# Altium schematic sheet schematic_updated.SchDoc
size 594 x 420 mm
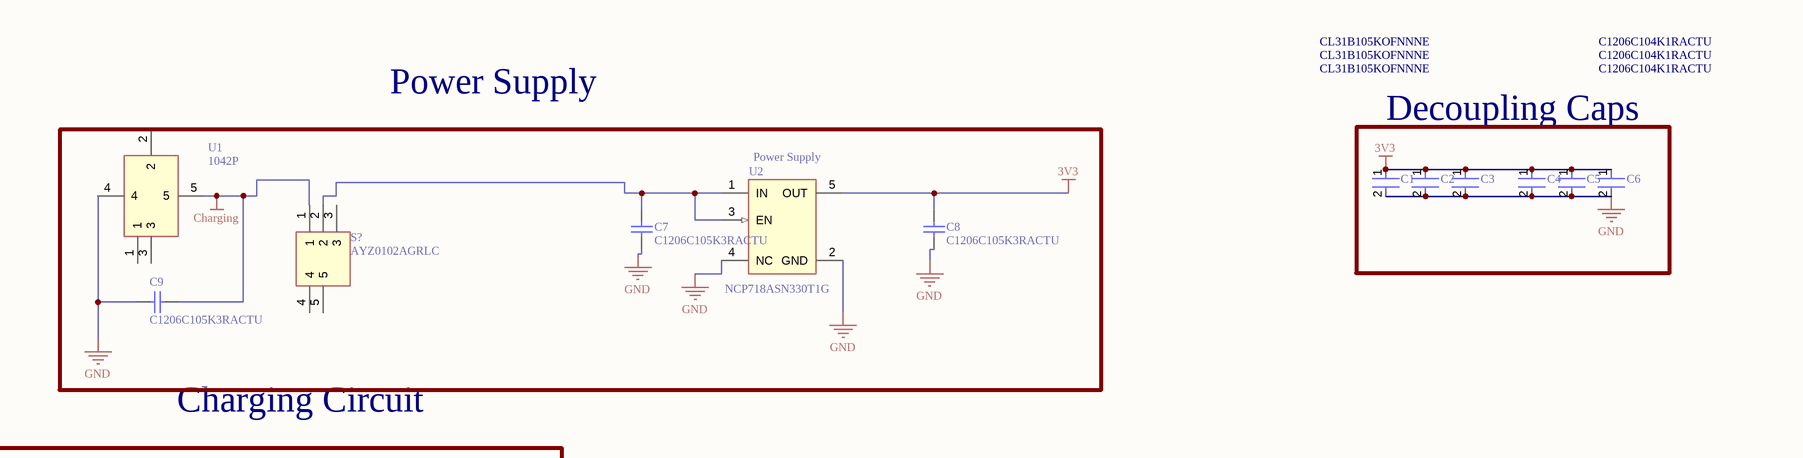
[diagram p0: schematic_updated.SchDoc, top left]
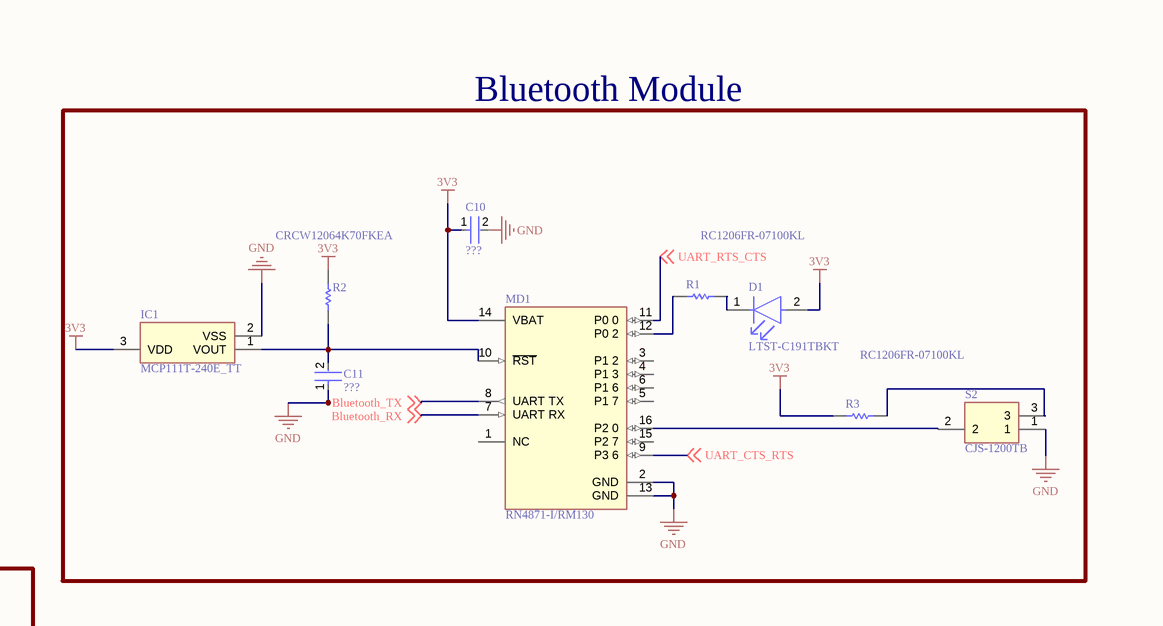
[diagram p1: schematic_updated.SchDoc, top right]
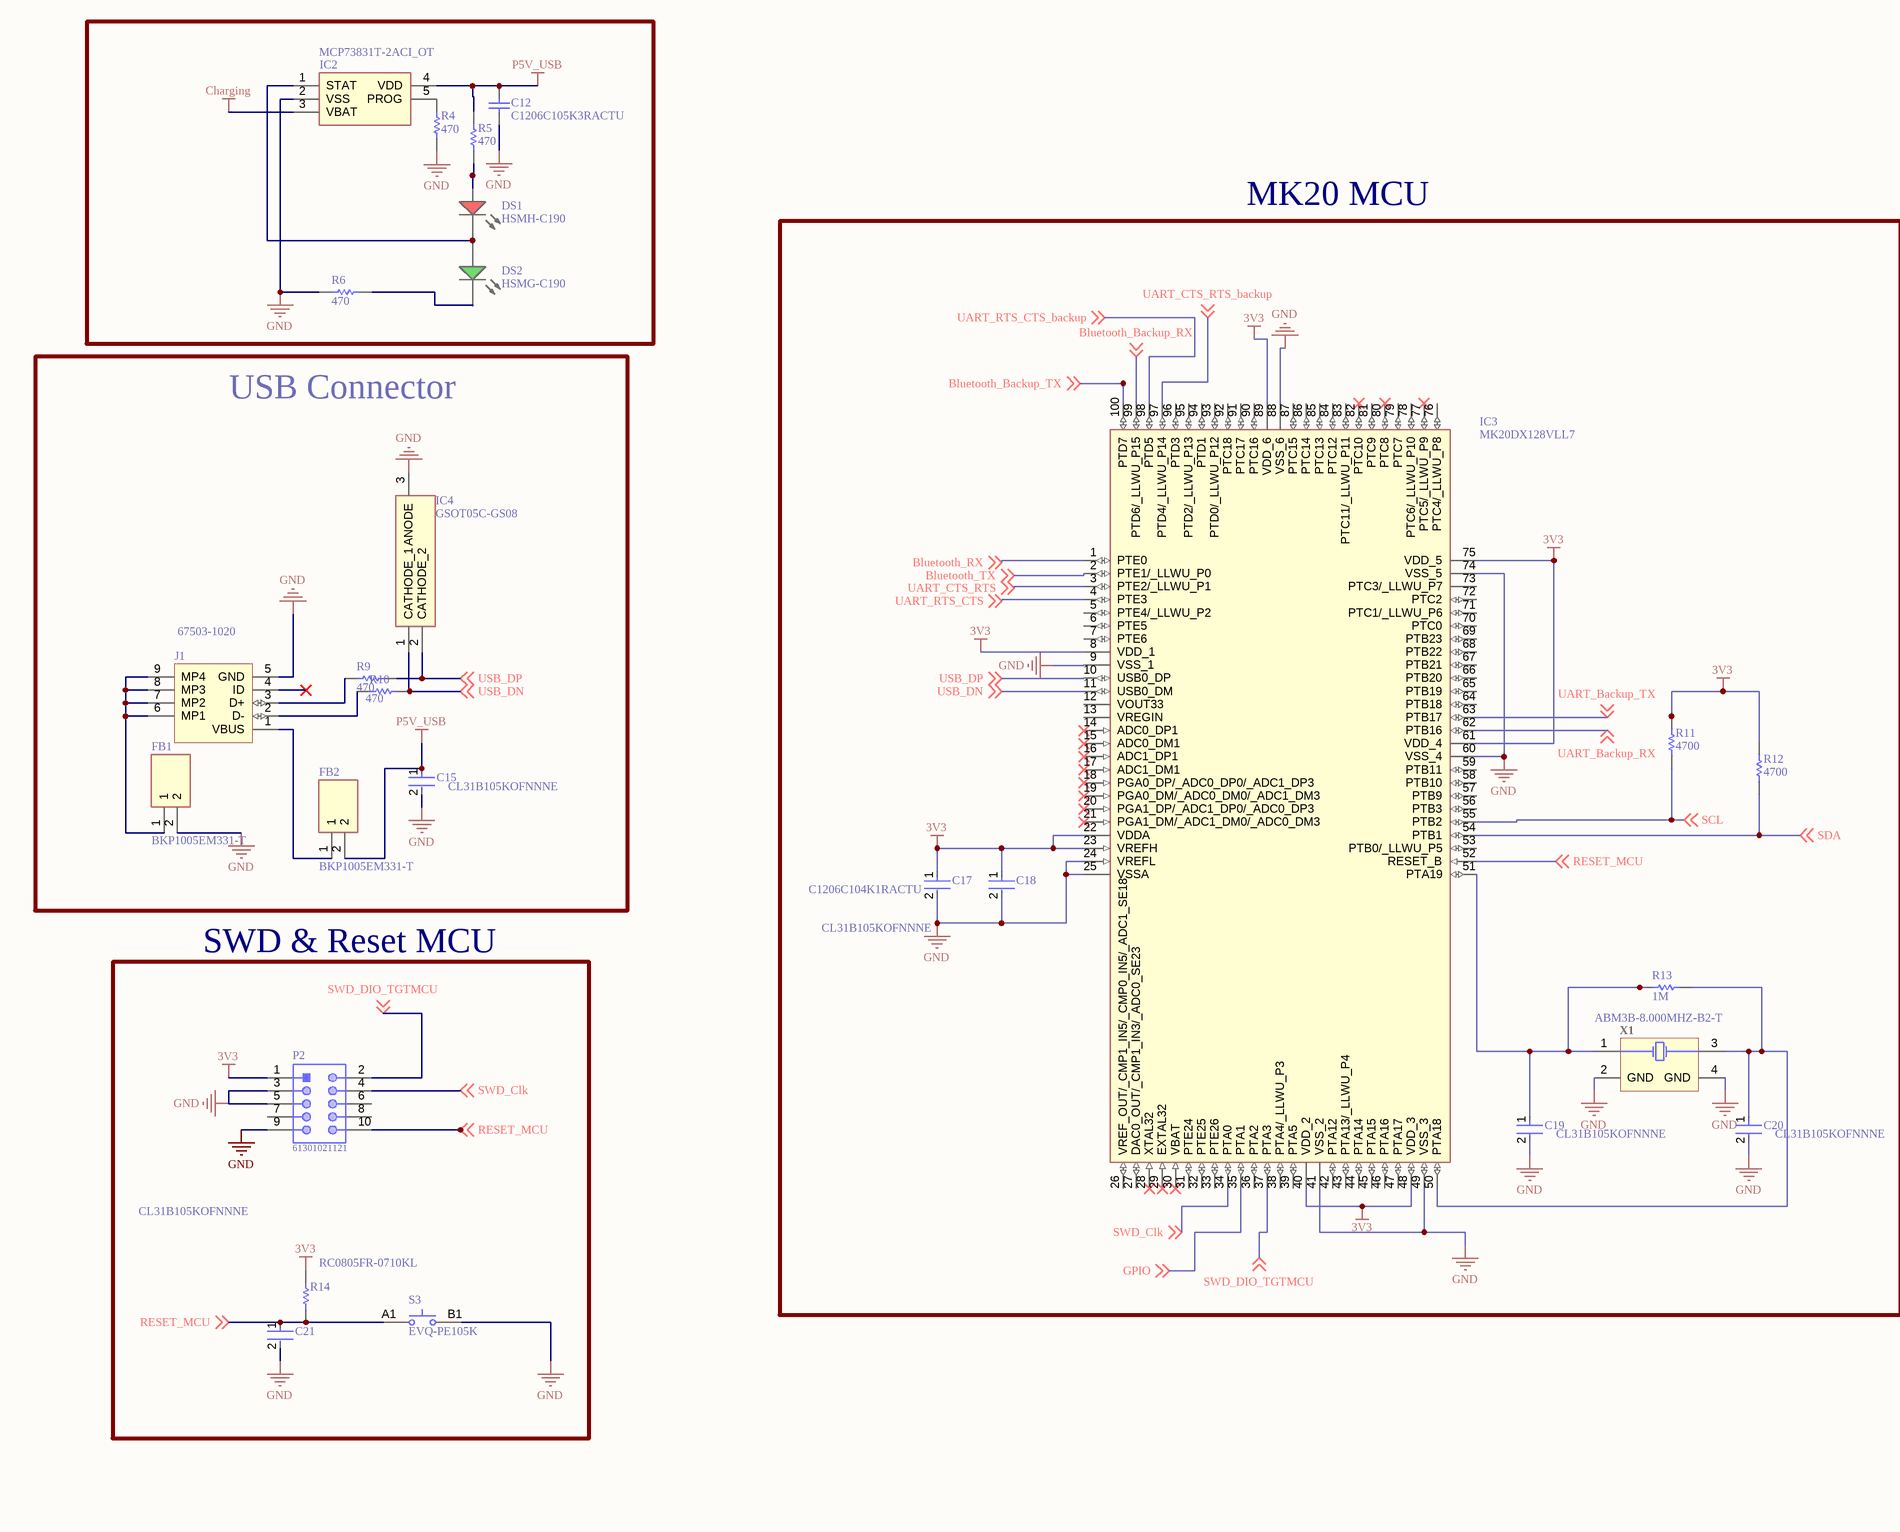
[diagram p2: schematic_updated.SchDoc, bottom left]
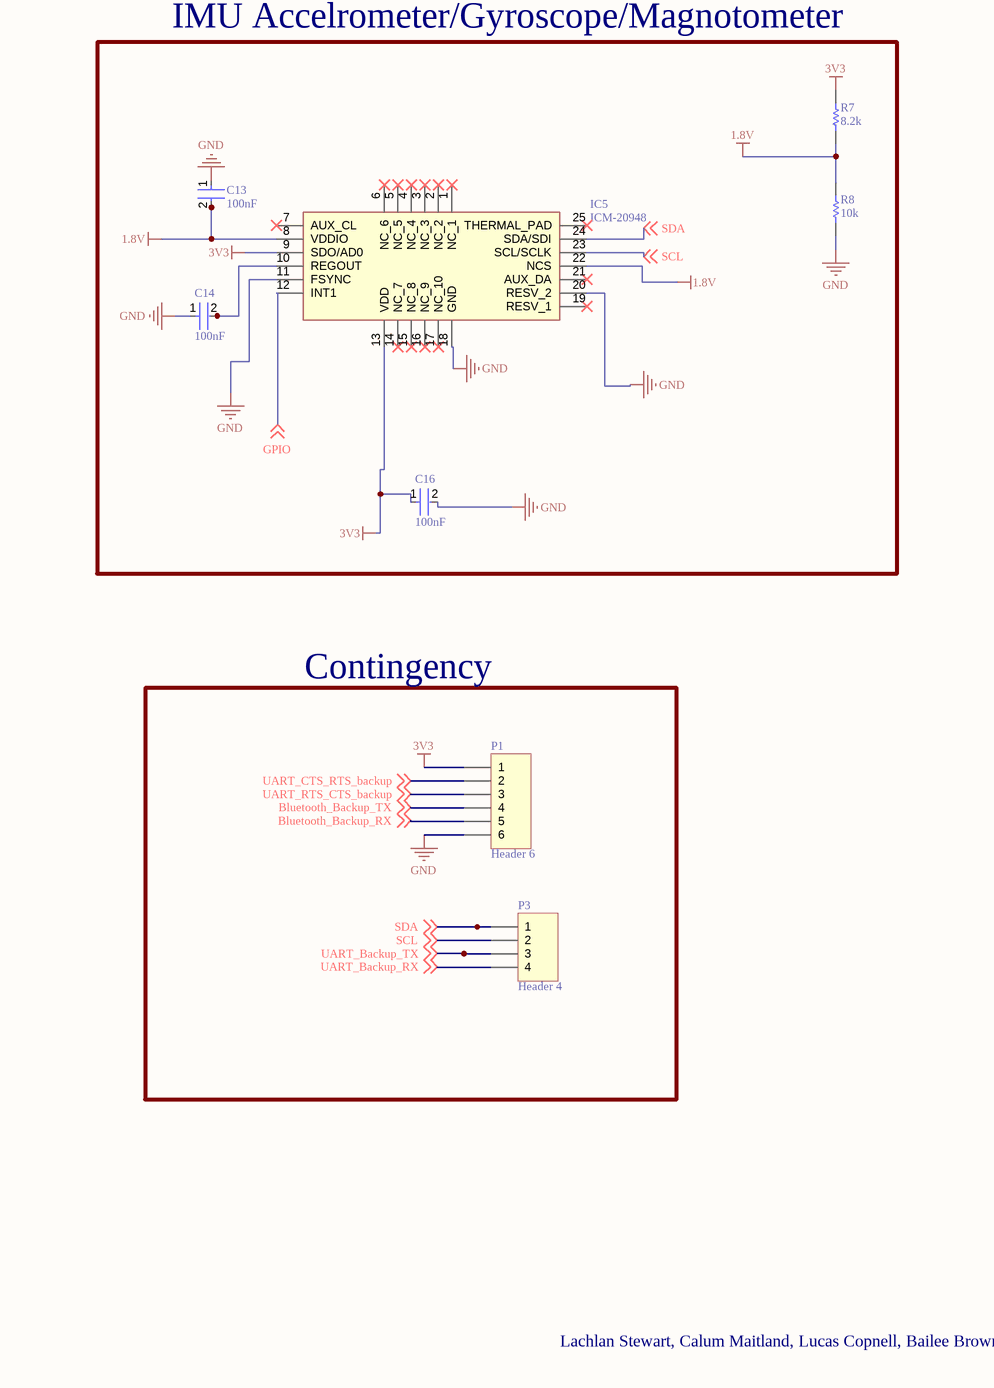
[diagram p3: schematic_updated.SchDoc, bottom right]

## Parts
C1  CL31B105KOFNNNE  [FP-CL31-IPC_C]
C2  CL31B105KOFNNNE  [FP-CL31-IPC_C]
C3  CL31B105KOFNNNE  [FP-CL31-IPC_C]
C4  C1206C104K1RACTU  [FP-C1206C-EB-MFG]
C5  C1206C104K1RACTU  [FP-C1206C-EB-MFG]
C6  C1206C104K1RACTU  [FP-C1206C-EB-MFG]
C7  C1206C105K3RACTU  [CAPC3216X180X50ML20T25]
C8  C1206C105K3RACTU  [CAPC3216X180X50ML20T25]
C9  C1206C105K3RACTU  [CAPC3216X180X50ML20T25]
C10  ???  [FP-CL31-IPC_C]
C11  ???  [FP-CL31-IPC_C]
C12  C1206C105K3RACTU  [CAPC3216X180X50ML20T25]
C13  100nF  [FP-CL31-IPC_C]
C14  100nF  [FP-CL31-IPC_C]
C15  CL31B105KOFNNNE  [FP-CL31-IPC_C]
C16  100nF  [FP-CL31-IPC_C]
C17  C1206C104K1RACTU  [FP-C1206C-EB-MFG]
C18  CL31B105KOFNNNE  [FP-CL31-IPC_C]
C19  CL31B105KOFNNNE  [FP-CL31-IPC_C]
C20  CL31B105KOFNNNE  [FP-CL31-IPC_C]
C21  CL31B105KOFNNNE  [FP-CL31-IPC_C]
D1  LTST-C191TBKT  [FP-LTST-C191TBKT-MFG]
DS1  HSMH-C190  [AVAG-HSMX-C190_V]
DS2  HSMG-C190  [AVAG-HSMX-C190_V]
FB1  BKP1005EM331-T  [BEADC1005X55N]
FB2  BKP1005EM331-T  [BEADC1005X55N]
IC1  MCP111T-240E_TT  [SOT95P237X112-3N]
IC2  MCP73831T-2ACI_OT  [SOT95P270X145-5N]
IC3  MK20DX128VLL7  [QFP50P1600X1600X170-100N]
IC4  GSOT05C-GS08  [SOT95P248X115-3N]
IC5  ICM-20948  [QFN40P300X300X105-25N-D]
J1  67503-1020  [MOLX-67503-1020_V]
MD1  RN4871-I/RM130  [FP-RN4871-I-RM130-MFG]
P1  Header 6  [HDR1X6]
P2  61301021121  [61301021121]
P3  Header 4  [HDR1X4]
R1  RC1206FR-07100KL  [RESC3116X65X40ML10T20]
R2  CRCW12064K70FKEA  [RESC3216X60X45ML15T20]
R3  RC1206FR-07100KL  [RESC3116X65X40ML10T20]
R4  value 470  [RESC3116X70X50ML13T20]  (hidden comment: Resistor 0R +/- 0.05% 1206 250 mW)
R5  value 470  [RESC3116X70X50ML13T20]  (hidden comment: Resistor 0R +/- 0.05% 1206 250 mW)
R6  value 470  [RESC3116X70X50ML13T20]  (hidden comment: Resistor 0R +/- 0.05% 1206 250 mW)
R7  value 8.2k  [RESC3116X70X50ML13T20]  (hidden comment: Resistor 0R +/- 0.05% 1206 250 mW)
R8  value 10k  [RESC3116X70X50ML13T20]  (hidden comment: Resistor 0R +/- 0.05% 1206 250 mW)
R9  value 470  [RESC3116X70X50ML13T20]  (hidden comment: Resistor 0R +/- 0.05% 1206 250 mW)
R10  value 470  [RESC3116X70X50ML13T20]  (hidden comment: Resistor 0R +/- 0.05% 1206 250 mW)
R11  value 4700  [RESC3116X70X50ML13T20]  (hidden comment: Resistor 0R +/- 0.05% 1206 250 mW)
R12  value 4700  [RESC3116X70X50ML13T20]  (hidden comment: Resistor 0R +/- 0.05% 1206 250 mW)
R13  value 1M  [RESC3116X70X50ML13T20]  (hidden comment: Resistor 0R +/- 0.05% 1206 250 mW)
R14  RC0805FR-0710KL  [RESC2013X60X35NL10T20]
S2  CJS-1200TB  [B-TYPE]
S3  EVQ-PE105K  [EVQPE105K]
S?  AYZ0102AGRLC  [AYZ0102AGRLC]
U1  1042P  [1042P]
U2  NCP718ASN330T1G  [FP-419AE-01-IPC_C]
X1  ABM3B-8.000MHZ-B2-T  [ABRA-ABM3B_V]

## Blocks framed on the sheet
Power Supply: C7-C9 S? U1 U2
Decoupling Caps: C1-C6
Bluetooth Module: C10 C11 D1 IC1 MD1 R1-R3 S2
MK20 MCU: C17-C20 IC3 R11-R13 X1
USB Connector: C15 FB1 FB2 IC4 J1 R9 R10
IMU Accelrometer/Gyroscope/Magnotometer: C13 C14 C16 IC5 R7 R8
SWD & Reset MCU: C21 P2 R14 S3
Contingency: P1 P3

## Nets
1.8V: C13.2 IC5.8(VDDIO) IC5.22(NCS) R7.2 R8.1
3V3: C1.1 C2.1 C3.1 C4.1 C5.1 C6.1 C8.1 C10.1 C16.1 C17.1 C18.1 D1.2(A) IC1.3(VDD) IC3.8(VDD_1) IC3.22(VDDA) IC3.23(VREFH) IC3.40(VDD_2) IC3.48(VDD_3) IC3.61(VDD_4) IC3.75(VDD_5) IC3.89(VDD_6) IC5.9(SDO/AD0) IC5.13(VDD) MD1.14(VBAT) P1.1 P2.1 R2.2 R3.1 R7.1 R11.1 R12.1 R14.2 U2.5(OUT)
Charging: C9.1 IC2.3(VBAT) S?.1 U1.5
GND: C1.2 C2.2 C3.2 C4.2 C5.2 C6.2 C7.2 C8.2 C9.2 C10.2 C11.1 C12.2 C13.1 C14.1 C15.2 C16.2 C17.2 C18.2 C19.2 C20.2 C21.2 FB1.2 IC1.2(VSS) IC2.2(VSS) IC3.9(VSS_1) IC3.24(VREFL) IC3.25(VSSA) IC3.41(VSS_2) IC3.49(VSS_3) IC3.60(VSS_4) IC3.74(VSS_5) IC3.88(VSS_6) IC5.11(FSYNC) IC5.18(GND) IC5.20(RESV_2) J1.5(GND) MD1.2(GND) MD1.13(GND) P1.6 P2.3 P2.5 P2.9 R4.1 R6.2 R8.2 S2.1 S3.B1(COM) U1.4 U2.2(GND) U2.4(NC) X1.2(GND) X1.4(GND)
P5V_USB: C12.1 C15.1 FB2.2 IC2.4(VDD) R5.2
Bluetooth_Backup_RX: IC3.99(PTD6/_LLWU_P15) P1.5 ; off-sheet Bluetooth_Backup_RX
Bluetooth_Backup_TX: IC3.100(PTD7) P1.4 ; off-sheet Bluetooth_Backup_TX
Bluetooth_RX: IC3.1(PTE0) MD1.7(UART_RX) ; off-sheet Bluetooth_RX
Bluetooth_TX: IC3.2(PTE1/_LLWU_P0) MD1.8(UART_TX) ; off-sheet Bluetooth_TX
GPIO: IC3.35(PTA1) IC5.12(INT1) ; off-sheet GPIO
RESET_MCU: C21.1 IC3.52(RESET_B) P2.10 R14.1 S3.A1(N.O.) ; off-sheet RESET_MCU
SCL: IC3.55(PTB2) IC5.23(SCL/SCLK) P3.2 R11.2 ; off-sheet SCL
SDA: IC3.54(PTB1) IC5.24(SDA/SDI) P3.1 R12.2 ; off-sheet SDA
SWD_Clk: IC3.34(PTA0) P2.4 ; off-sheet SWD_Clk
SWD_DIO_TGTMCU: IC3.37(PTA3) P2.2 ; off-sheet SWD_DIO_TGTMCU
UART_Backup_RX: IC3.62(PTB16) P3.4 ; off-sheet UART_Backup_RX
UART_Backup_TX: IC3.63(PTB17) P3.3 ; off-sheet UART_Backup_TX
UART_CTS_RTS: IC3.3(PTE2/_LLWU_P1) MD1.9(P3_6) ; off-sheet UART_CTS_RTS
UART_CTS_RTS_backup: IC3.97(PTD4/_LLWU_P14) P1.2 ; off-sheet UART_CTS_RTS_backup
UART_RTS_CTS: IC3.4(PTE3) MD1.11(P0_0) ; off-sheet UART_RTS_CTS
UART_RTS_CTS_backup: IC3.98(PTD5) P1.3 ; off-sheet UART_RTS_CTS_backup
USB_DN: IC3.11(USB0_DM) IC4.1(CATHODE_1) R10.1 ; off-sheet USB_DN
USB_DP: IC3.10(USB0_DP) IC4.2(CATHODE_2) R9.1 ; off-sheet USB_DP
NetC7_1: C7.1 S?.2 U2.1(IN) U2.3(EN)
NetC11_2: C11.2 IC1.1(VOUT) MD1.10(~{RST}) R2.1
NetC14_2: C14.2 IC5.10(REGOUT)
NetC19_1: C19.1 IC3.51(PTA19) R13.1 X1.1(X1)
NetC20_1: C20.1 IC3.50(PTA18) R13.2 X1.3(X2)
NetD1_1: D1.1(C) R1.2
NetDS1_1: DS1.1(A) R5.1
NetDS1_2: DS1.2(K) DS2.1(A) IC2.1(STAT)
NetDS2_2: DS2.2(K) R6.1
NetFB1_1: FB1.1 J1.6(MP1) J1.7(MP2) J1.8(MP3) J1.9(MP4)
NetFB2_1: FB2.1 J1.1(VBUS)
NetIC2_5: IC2.5(PROG) R4.2
NetJ1_2: J1.2(D-) R10.2
NetJ1_3: J1.3(D+) R9.2
NetMD1_12: MD1.12(P0_2) R1.1
NetMD1_16: MD1.16(P2_0) S2.2
NetR3_2: R3.2 S2.3

Not connected (* = marked no-connect by the designer): IC3 5(PTE4/_LLWU_P2) 6(PTE5) 7(PTE6) 12(VOUT33) 13(VREGIN) 14(ADC0_DP1)* 15(ADC0_DM1)* 16(ADC1_DP1)* 17(ADC1_DM1)* 18(PGA0_DP/_ADC0_DP0/_ADC1_DP3)* 19(PGA0_DM/_ADC0_DM0/_ADC1_DM3)* 20(PGA1_DP/_ADC1_DP0/_ADC0_DP3)* 21(PGA1_DM/_ADC1_DM0/_ADC0_DM3)* 26(VREF_OUT/_CMP1_IN5/_CMP0_IN5/_ADC1_SE18) 27(DAC0_OUT/_CMP1_IN3/_ADC0_SE23) 28(XTAL32)* 29(EXTAL32)* 30(VBAT)* 31(PTE24) 32(PTE25) 33(PTE26) 36(PTA2) 38(PTA4/_LLWU_P3) 39(PTA5) 42(PTA12) 43(PTA13/_LLWU_P4) 44(PTA14) 45(PTA15) 46(PTA16) 47(PTA17) 53(PTB0/_LLWU_P5) 56(PTB3) 57(PTB9) 58(PTB10) 59(PTB11) 64(PTB18) 65(PTB19) 66(PTB20) 67(PTB21) 68(PTB22) 69(PTB23) 70(PTC0) 71(PTC1/_LLWU_P6) 72(PTC2) 73(PTC3/_LLWU_P7) 76(PTC4/_LLWU_P8) 77(PTC5/_LLWU_P9)* 78(PTC6/_LLWU_P10) 79(PTC7) 80(PTC8)* 81(PTC9) 82(PTC10)* 83(PTC11/_LLWU_P11) 84(PTC12) 85(PTC13) 86(PTC14) 87(PTC15) 90(PTC16) 91(PTC17) 92(PTC18) 93(PTD0/_LLWU_P12) 94(PTD1) 95(PTD2/_LLWU_P13) 96(PTD3); IC4 3(ANODE); IC5 1(NC_1)* 2(NC_2)* 3(NC_3)* 4(NC_4)* 5(NC_5)* 6(NC_6)* 7(AUX_CL)* 14(NC_7)* 15(NC_8)* 16(NC_9)* 17(NC_10)* 19(RESV_1)* 21(AUX_DA)* 25(THERMAL_PAD)*; J1 4(ID)*; MD1 1(NC) 3(P1_2) 4(P1_3) 5(P1_7) 6(P1_6) 15(P2_7); P2 6 7 8; S? 3 4 5; U1 1 2 3

## Notes on the sheet
- Power Supply
- Charging Circuit
- Lachlan Stewart, Calum Maitland, Lucas Copnell, Bailee Brown
- Labels drawn without touching a wire or pin: GND
- 10
- 9
- 8
- 7
- 6
- 5
- 4
- 3
- DWG. NO.
- 2
- 1
- THIS DOCUMENT AND THE DATA DISCLOSED HEREIN OR HEREWITH IS THE PROPERTY OF ALTIUM LIMITED AND MAY BE FREELY DISTRIBUTED IN WHOLE. NO RIGHTS ARE RESERVED OR EXPRESS OR IMPLIED WARANTEE GIVEN.
- REV.
- SHT.
- REVISION
- DESCRIPTION
- DATE
- APPROVED
- H
- G
- F
- E
- D
- C
- B
- A
- TITLE
- SCALE:
- A2
- SIZE
- CAGE CODE
- FILE NAME
- DWG NO.
- SHEET
- OF
- REV

## Library data of the parts
C1-C3 C10 C11 C13-C16 C18-C21 = CMP-13271-000025-1: Cap Ceramic 1uF 16V X7R ±10% SMD 1206 +125°C Embossed T/R; Package Quantity: 1; Voltage: 16V; Depth: 1.6mm; Thickness: 0.055inch; Contact Plating: Tin; Lead Free: Lead Free; Voltage Rating (DC): 16V; Material: Ceramic; Mount: Surface Mount; Case Code (Metric): 3216; Capacitance: 1uF; Case/Package: 1206; Width: 0.063inch; Voltage Rating: 16V; Height: 1.25mm; Packaging: Tape and Reel; Radiation Hardening: No; Dielectric: X7R; Min Operating Temperature: -55°C; Max Operating Temperature: 125°C; Length: 3.2mm; Tolerance: 10%; Case Code (Imperial): 1206
C4-C6 C17 = CMP-03020-000153-1: CAP CER 0.1UF 100V X7R 1206; Manufacturer: KEMET; Value: 0.10 μF; Tolerance: 0.1; Material: Ceramic; Temperature Coefficient: 15%; Automotive Grade: Grade 0; Voltage Rating: 100 V; Automotive: Yes; Ipc Land Pattern Name: CAPC320160X78; Device Class L1: Passive Components; ComponentLink2Description: Datasheet; Temperature Range Low: -55°C; Category: Cap; Octopart: https://octopart.com/c1206c104k1ractu-kemet-89521; Height: 0.88mm; Lead Free: Yes; Digikey Description: CAP CER 0.1UF 100V X7R 1206; Mouser Description: CAP CER 0.1UF 100V X7R 1206; Device Class L3: Ceramic Capacitors; Device Class L2: Capacitors; ComponentLink2URL: https://content.kemet.com/datasheets/KEM_C1007_X8R_ULTRA_150C_SMD.pdf; Temperature Range High: +150°C; Temperature Characteristic: X7R; Manufacturer Part Number: C1206C104K1RACTU; RoHS: TRUE; Capacitance: 0.10 μF; Package: C1206C-EB; Temperature: -55°C to +150°C
C7-C9 C12 = CMP-2000-04991-1: Chip Capacitor, 1 uF, +/- 10%, 25 V, -55 to 125 degC, 1206 (3216 Metric), RoHS, Tape and Reel; Manufacturer: Kemet; Temperature Coefficient / Code: +/-15%; Capacitance: 1uF; Dielectric: X7R; Voltage Rating DC: 25V; Capacitance - nF: 1000nF; Class: Class1; Case Length: 3.2mm; Type: SMDMLCCX7R6.3-250VDCCommericalGrade; Case Width: 1.6mm; Product: GeneralTypeMLCCs; Datasheet URL: https://ciiva.com/datasheet-click-18194173?src=ciiva&sig=6daff8c4; Operating Temperature Range: -55Cto+125C; Series: C1206C; RoHS: Details; Product Category: MultilayerCeramicCapacitorsMLCC-SMD/SMT; Manufacturer URL: http://www.kemet.com/; Minimum Operating Temperature: -55C; Dimensions: 1.6mmWx3.2mmLx1.6mmH; Termination Style: SMD/SMT; Brand: Kemet; Packaging: Reel; Package / Case: 1206(3216metric); Case Code - mm: 3216; Datasheet Version: Jul-14; Factory Pack Quantity: 2000; Package Description: 2-Pin Surface Mount Device, Body 3.2 x 1.6 mm; Tolerance: 10%; Package Reference: 1206; Case Height: 1.6mm; Case Code - in: 1206; Maximum Operating Temperature: +125C; Voltage Rating: 25V
D1 = CMP-22017-000008-1: LED BLUE CLEAR CHIP SMD; Lens Color: Colorless; Dominant Wavelength: 475nm; Forward Current: 20mA; Wavelength: 468nm; Viewing Angle: 130°; Power Dissipation: 76mW; Luminous Intensity: 180mcd; Reverse Voltage: 5V; Number of Elements: 1; Lens Style: Diffused; Forward Voltage: 3.8V; Max Power Dissipation: 75mW; Case Code (Metric): 1608; Packaging: Tape and Reel; Case/Package: 0603; Depth: 1.6mm; Mount: Surface Mount; Lead Free: Lead Free; Min Operating Temperature: -20°C; Lens Transparency: Clear; Illumination Color: Blue; Height: 0.55mm; Test Current: 20mA; Case Code (Imperial): 0603; Max Operating Temperature: 80°C; Number of Pins: 2; Length: 0.8mm; Radiation Hardening: No; Package Quantity: 1; Number of LEDs: 1; Width: 0.8mm; Color: Blue
DS1 = CMP-1744-00004-1: LED Uni-Color Red, 65 mW, 20 mA, -40 to 85 degC, 2-Pin SMD, RoHS, Tape and Reel; Connector Type: USB; Gender: Male; Current Rating: 1 A; Length: 7.5 mm; Lead Pitch: 0.65 mm; PackageReference: HSMX-C190; Package Quantity: 2000; Max Operating Temperature: 85 degC; PackageDescription: 2-Pin Surface Mount Device, Body 1.6 x 0.8 mm, Height 0.9 mm; ComponentLink3Description: Package Specification; Mount: Surface Mount; Min Operating Temperature: -30 degC; ComponentLink3URL: http://www.fairchildsemi.com/dwg/MA/MA03D.pdf; ComponentLink1Description: Manufacturer URL; Contact Material: Copper; Pins: 5; Width: 5.6 mm; ComponentLink2Description: Datasheet; RoHSCompliant: true; DatasheetVersion: Mar-12; Height: 2.8 mm; Packaging: Tape and Reel; Contact Plating: Gold; ComponentLink1URL: http://www.avagotech.com/; REACH SVHC: No SVHC; ComponentLink2URL: http://docs.avagotech.com/docs/AV02-0551EN
DS2 = CMP-1744-00002-1: Chip LED, Green, 2.2 V, -40 to 85 degC, 2-Pin SMD, RoHS, Tape and Reel; Frequency: 400 KHz; Max Supply Voltage: 5.5 V; Access Time: 3500 ns; Clock Frequency: 100 KHz; Case\Package: SOIC; Density: 32 kb; Nominal Supply Current: 2 mA; Interface: Serial; Min Supply Voltage: 1.7 V; Packaging: Tape and Reel; PackageReference: HSMX-C190; ComponentLink2URL: http://docs.avagotech.com/docs/AV02-0551EN; RoHSCompliant: true; Pins: 8; REACH SVHC: No SVHC; Max Operating Temperature: 85 degC; Width: 4 mm; Radiation Hardening: No; Package Quantity: 3000; ComponentLink3Description: Package Specification; ComponentLink1Description: Manufacturer URL; Min Operating Temperature: -40 degC; PackageDescription: 2-Pin Surface Mount Device, Body 1.6 x 0.8 mm, Height 0.9 mm; Max Clock Frequency: 100 KHz; Height: 1.5 mm; ComponentLink1URL: http://www.avagotech.com/; DatasheetVersion: Mar-12; ComponentLink2Description: Datasheet; Mount: Surface Mount; Length: 5 mm; ComponentLink3URL: http://www.fairchildsemi.com/dwg/MA/MA03D.pdf
FB1 FB2 = BKP1005EM331-T: Ferrite Bead; Manufacturer_Name: TAIYO YUDEN; Datasheet Link: http://ds.yuden.co.jp/TYCOMPAS/ut/detail.do?productNo=BKP1005EM331-T&fileName=BKP1005EM331-T_SS&mode=specSheetDownload; Height: 0.55mm; Manufacturer_Part_Number: BKP1005EM331-T; Arrow Part Number: BKP1005EM331-T; Mouser Part Number: 963-BKP1005EM331-T; Mouser Price/Stock: https://www.mouser.com/Search/Refine.aspx?Keyword=963-BKP1005EM331-T
IC1 = MCP111T-240E_TT: Integrated Circuit; Manufacturer_Name: Microchip; Manufacturer_Part_Number: MCP111T-240E/TT; Datasheet Link: https://componentsearchengine.com/Datasheets/2/MCP111T-240E_TT.pdf; Height: 1.12mm; Arrow Part Number: MCP111T-240E/TT; Arrow Price/Stock: https://www.arrow.com/en/products/mcp111t-240ett/microchip-technology; Mouser Part Number: 579-MCP111T-240E/TT; Mouser Price/Stock: https://www.mouser.co.uk/ProductDetail/Microchip-Technology/MCP111T-240E-TT?qs=L9Ynyw3fbhE3rmLkD5w19g%3D%3D
IC2 = MCP73831T-2ACI_OT: Integrated Circuit; Manufacturer_Name: Microchip; Manufacturer_Part_Number: MCP73831T-2ACI/OT; Datasheet Link: http://ww1.microchip.com/downloads/en/DeviceDoc/20001984g.pdf; Height: 1.45mm; Arrow Part Number: MCP73831T-2ACI/OT; Arrow Price/Stock: https://www.arrow.com/en/products/mcp73831t-2aciot/microchip-technology; Mouser Part Number: 579-MCP73831T-2ACIOT; Mouser Price/Stock: https://www.mouser.co.uk/ProductDetail/Microchip-Technology/MCP73831T-2ACI-OT?qs=yUQqVecv4qvbBQBGbHx0Mw%3D%3D
IC3 = MK20DX128VLL7: Integrated Circuit; Manufacturer_Name: NXP; Datasheet Link: http://www.nxp.com/docs/en/data-sheet/K20P100M72SF1.pdf; Height: 1.7mm; Manufacturer_Part_Number: MK20DX128VLL7; Arrow Part Number: MK20DX128VLL7; Arrow Price/Stock: https://www.arrow.com/en/products/mk20dx128vll7/nxp-semiconductors; Mouser Part Number: 841-MK20DX128VLL7; Mouser Price/Stock: https://www.mouser.co.uk/ProductDetail/NXP-Semiconductors/MK20DX128VLL7?qs=WtedIhRlNpuHThscd5qw9w%3D%3D
IC4 = GSOT05C-GS08: Integrated Circuit; Manufacturer_Name: Vishay; Datasheet Link: https://www.vishay.com/docs/85824/gsot03c.pdf; Height: 1.15mm; Manufacturer_Part_Number: GSOT05C-GS08; Arrow Part Number: GSOT05C-GS08; Mouser Part Number: 78-GSOT05C; Mouser Price/Stock: https://www.mouser.com/Search/Refine.aspx?Keyword=78-GSOT05C
IC5 = ICM-20948: Integrated Circuit; Manufacturer_Name: InvenSense Inc.; Datasheet Link: https://www.invensense.com/wp-content/uploads/2016/06/DS-000189-ICM-20948-v1.3.pdf; Height: 1.05mm; Manufacturer_Part_Number: ICM-20948; Arrow Part Number: ICM-20948; Arrow Price/Stock: https://www.arrow.com/en/products/icm-20948/invensense; Mouser Part Number: 410-ICM-20948; Mouser Price/Stock: https://www.mouser.co.uk/ProductDetail/TDK-InvenSense/ICM-20948?qs=u4fy%2FsgLU9OtGc31yF%2Friw%3D%3D
J1 = CMP-0411-00002-1: USB, MINI, SMD, RA KME04-USBMU03A01; Manufacturer: Molex; ComponentLink1URL: http://www.molex.com/; PartNumber: 67503-1020; Mounting Technology: Surface Mount; ComponentLink1Description: Manufacturer URL; Terminal Pitch: 0.8 mm; DatasheetVersion: Rev F, 06/2009; ComponentLink2Description: Datasheet; PackageDescription: Mini USB Connector, SMT, Righer Angle; ComponentLink2URL: http://www.molex.com/pdm_docs/sd/675031020_sd.pdf; PackageReference: 67503-1020
MD1 = CMP-06331-000010-1: BLUETOOTH BLE MODULE, SHIELDED,; Manufacturer: Microchip; Sensitivity: -90dBm; Transmitting Current: 10mA; Nominal Supply Current: 80-2230uA; Number Of Gpio: 4; Bandwidth: 78MHz; Data Rate: 10kbits/s; Interface: I2C,SPI,UART,Other; Max Frequency: 2.48GHz; Max Supply Voltage: 3.6V; Min Supply Voltage: 1.9V; RoHS: TRUE; Height: 2.16mm; Manufacturer Part Number: RN4871-I/RM130; ComponentLink2URL: http://ww1.microchip.com/downloads/en/DeviceDoc/RN4870-71-Bluetooth-Low-Energy-Module-Data-Sheet-DS50002489D.pdf; Device Class L1: Integrated Circuits (ICs); Lead Free: Yes; Digikey Description: BLUETOOTH BLE MODULE, SHIELDED,; Package: 0; Temperature Range High: +85°C; ComponentLink2Description: Datasheet; Device Class L3: Transceivers; Temperature: -40°C to +85°C; Mouser Description: Bluetooth Ble Module, Shielded, Antenna, Ascii Interface, 9X11.5Mm 16 Module 11.5X9x2.1 Mm Tray; Receiving Current: 10mA; Category: UNK; Automotive: No; Temperature Range Low: -40°C; Device Class L2: RF Semiconductors and Devices; Octopart: https://octopart.com/rn4871-i%2Frm130-microchip-92006868
P1 = Header 6: Header, 6-Pin; LatestRevisionDate: 17-Jul-2002; LatestRevisionNote: Re-released for DXP Platform.; Publisher: Altium Limited
P2 = CMP-1502-01084-1: THT Vertical Pin Header WR-PHD, Pitch 2.54 mm, Dual Row, 10 pins; Manufacturer: Wurth Elektronik; Working Voltage: 250VAC; Pitch: 2.54mm; Contact Resistance: 20mOhm; Gender: Male; Rated Current: 3A; Withstanding Voltage: 500VAC; Pin Number: 10; Operating Temperature: -40to105degC; Mounting Technology: THT; Publisher: WurthElektronik; Manufacturer URL: http://www.we-online.de; Part Number: 61301021121; Row Number: Dual; Packaging: Bag; Orientation: Vertical; Package Reference: 61301021121; Datasheet URL: https://katalog.we-online.de/em/datasheet/6130xx21121.pdf
P3 = Header 4: Header, 4-Pin; LatestRevisionDate: 17-Jul-2002; LatestRevisionNote: Re-released for DXP Platform.; Publisher: Altium Limited
R1 R3 = CMP-2100-03674-1: Chip Resistor, 100 KOhm, +/- 1%, 0.25 W, -55 to 155 degC, 1206 (3216 Metric), RoHS, Tape and Reel; Manufacturer: Yageo; Voltage Rating: 200V; Temperature Coefficient: 100ppm/degreesC; Power Rating: 250mW; Case Code (Metric): 3216; Composition: ThickFilm; Lead Free: LeadFree; Max Operating Temperature: 155degC; Case/Package: 1206; Min Operating Temperature: -55degC; Depth: 1.6mm; RoHSCompliant: true; Datasheet URL: http://www.yageo.com/NewPortal/yageodocoutput?fileName=/pdf/R-Chip/PYu-RC_Group_51_RoHS_L_5.pdf; Datasheet Version: Rev. 5, 10/2016; Package Reference: 1206.0; Packaging: TapeandReel; Resistance: 100KOhm; Manufacturer URL: http://www.yageo.com/; Tolerance: 1%; Height: 0.55mm; REACH SVHC: NoSVHC; Case Code (Imperial): 1206; Length: 3.1mm; Package Description: 2-Pin Surface Mount Device, Body 3.1 x 1.6 mm; Termination: SMD/SMT
R2 = CMP-2100-03618-1: Chip Resistor, 4.7 KOhm, +/- 1%, 0.25 W, -55 to 155 degC, 1206 (3216 Metric), RoHS, Tape and Reel; Manufacturer: Vishay Semiconductor; Power Rating: 250mW; Voltage Rating: 200V; Temperature Coefficient: 100ppm/degreesC; Package Quantity: 10; Composition: ThickFilm; REACH SVHC: Unknown; Mount: SurfaceMount; Max Operating Temperature: 155degC; Length: 3.2mm; Number of Terminations: 2; Case Code (Metric): 3216; Military Standard: Not; Width: 1.6mm; Datasheet Version: 41061.0; Max Power Dissipation: 250mW; Datasheet URL: http://www.vishay.com/docs/20035/dcrcwe3.pdf; Contact Plating: Tin; Case/Package: 1206; Height: 0.55mm; Package Reference: 1206.0; Lead Free: LeadFree; Weight: 0.000353oz; Package Description: 2-Pin Surface Mount Device, Body 3.15 x 1.6 mm; Min Operating Temperature: -55degC; Resistance: 4.7KOhm; Packaging: TapeandReel; Depth: 1.6mm; Tolerance: 1%; RoHSCompliant: true; Termination: SMD/SMT; Case Code (Imperial): 1206; Voltage Rating (DC): 200V; Radiation Hardening: No; Manufacturer URL: http://www.vishay.com/
R4-R13 = CMP-009-00008-4: Chip Resistor, 0 Ohm, 0.25 W, -55 to 155 degC, 1206 (3216 Metric); Voltage Rating: 200V; Power: 250mW; Tolerance: 0.05%; Max Operating Temperature: 155°C; RoHS Compliant: True; Min Operating Temperature: -55°C; Pins: 2; Case/Package: 1206; Mounting Technology: SM
R14 = CMP-1659-00013-4: Chip Resistor, 10 KOhm, +/- 1%, 0.125 W, -55 to 155 degC, 0805 (2012 Metric), RoHS, Tape and Reel; Manufacturer: Yageo; Voltage Rating: 150 V; Mount: Surface Mount; ComponentLink1Description: Manufacturer URL; ComponentLink2URL: http://www.yageo.com/documents/recent/PYu-RC_Group_51_RoHS_L_04.pdf; Pins: 2; Length: 2 mm; Min Operating Temperature: -55 degC; Height: 0.5 mm; Mounting Technology: Surface Mount; RoHSCompliant: true; REACH SVHC: No SVHC; ComponentLink1URL: http://www.yageo.com/; Max Operating Temperature: 155 degC; PackageReference: 0805; DatasheetVersion: Rev. 4, 02/2016; Package Quantity: 5000; Packaging: Tape and Reel; ComponentLink2Description: Datasheet; PackageDescription: 2-Pin Surface Mounted Device, Body 2 x 1.25 mm
S2 = CJS-1200TB: Switch; Manufacturer_Name: Copal Electronics; Datasheet Link: http://www.nidec-copal-electronics.com/e/catalog/switch/cjs.pdf; Manufacturer_Part_Number: CJS-1200TB; Arrow Part Number: CJS-1200TB
S3 = EVQ-PE105K: Switch (2-Pin Push); Manufacturer_Name: Panasonic; Datasheet Link: https://industrial.panasonic.com/cdbs/www-data/pdf/ATK0000/ATK0000C376.pdf; Height: 5mm; Manufacturer_Part_Number: EVQ-PE105K; Arrow Part Number: EVQ-PE105K; Arrow Price/Stock: https://www.arrow.com/en/products/evqpe105k/panasonic; Mouser Part Number: 667-EVQ-PE105K; Mouser Price/Stock: https://www.mouser.co.uk/ProductDetail/Panasonic/EVQ-PE105K?qs=WwqriLBepZvDjHzvpRBUaw%3D%3D
S? = AYZ0102AGRLC: Switch; Manufacturer_Name: C & K COMPONENTS; Datasheet Link: https://componentsearchengine.com/Datasheets/3/AYZ0102AGRLC.pdf; Height: 1mm; Manufacturer_Part_Number: AYZ0102AGRLC; Arrow Part Number: AYZ0102AGRLC; Arrow Price/Stock: https://www.arrow.com/en/products/ayz0102agrlc/ck; Mouser Part Number: 611-AYZ0102AGRLC; Mouser Price/Stock: https://www.mouser.co.uk/ProductDetail/CK/AYZ0102AGRLC?qs=dJbzCyn%252BCFYWKwcWEToS6A%3D%3D
U1 = 1042P: Undefined or Miscellaneous; Manufacturer_Name: Keystone Electronics; Datasheet Link: http://www.keyelco.com/product-pdf.cfm?p=13957; Height: 14mm; Manufacturer_Part_Number: 1042P; Arrow Part Number: 1042P; Arrow Price/Stock: https://www.arrow.com/en/products/1042p/keystone-electronics; Mouser Part Number: 534-1042P; Mouser Price/Stock: https://www.mouser.co.uk/ProductDetail/Keystone-Electronics/1042P?qs=g2rIOKKlpoboHyq0g1zn1A%3D%3D
U2 = CMP-07128-000009-1: 300 MA LOW IQ WIDE INPUT; Manufacturer: ON Semiconductor; Output Current: 800mA; Accuracy Percentage: 2%; Max Junction Temp: +150°C; Standoff Height: 0.01mm; Number Of Outputs: 1; Nominal Supply Current: 4uA; Max Supply Voltage: 24V; Min Supply Voltage: 2.5V; Output Type: Fixed; Output Voltage: 3.3V; Dropout Voltage: 275mV; Octopart: https://octopart.com/ncp718asn330t1g-on+semiconductor-87658778; Category: IC; Mouser Description: LDO Regulator, 300 mA, Wide Vin, Ultra-Low Iq Fixed 3.3V, Active Discharge, TSOT23-5; ComponentLink2Description: Datasheet; Height: 1mm; Device Class L2: Power Management ICs; Device Class L1: Integrated Circuits (ICs); ComponentLink2URL: https://www.onsemi.com/pub/Collateral/NCP718-D.PDF; Lead Free: Yes; Ipc Land Pattern Name: SOT95P280X100-5; Temperature Range High: +150°C; Device Class L3: Voltage Regulators - Linear; Package: 419AE-01; Digikey Description: 300 MA LOW IQ WIDE INPUT; Footprint Url: https://www.onsemi.com/pub/Collateral/419AE.PDF; Manufacturer Part Number: NCP718ASN330T1G; Automotive: No; Temperature: to +150°C; RoHS: TRUE
X1 = CMP-1688-00002-1: Ceramic SMD Crystal, 8 MHz, +/- 20 ppm, 200 Ohm, -20 to 70 degC, 4-Pin SMD, RoHS, Tape and Reel; Max Supply Voltage: 45 V; Outputs: 4; Min Supply Voltage: 8.2 V; Output Voltage: 3.3 V; Switching Frequency: 30 KHz; Output Current: 1.8 A; Packaging: Rail/Tube; ComponentLink2Description: Datasheet; REACH SVHC: No SVHC; ComponentLink1URL: http://www.abracon.com/; PackageReference: ABM3B; Weight: 0.004233 oz; Height: 1.05 mm; ComponentLink2URL: http://www.abracon.com/Resonators/abm3b.pdf; Mount: Surface Mount; Min Operating Temperature: -40 degC; Max Operating Temperature: 85 degC; Package Quantity: 50; PackageDescription: 4-Pin Surface Mount Device, Body 5 x 3.2 mm; Pins: 28; DatasheetVersion: Aug-15; ComponentLink1Description: Manufacturer URL; RoHSCompliant: true; Radiation Hardening: No; Length: 9.8 mm; Width: 4.5 mm